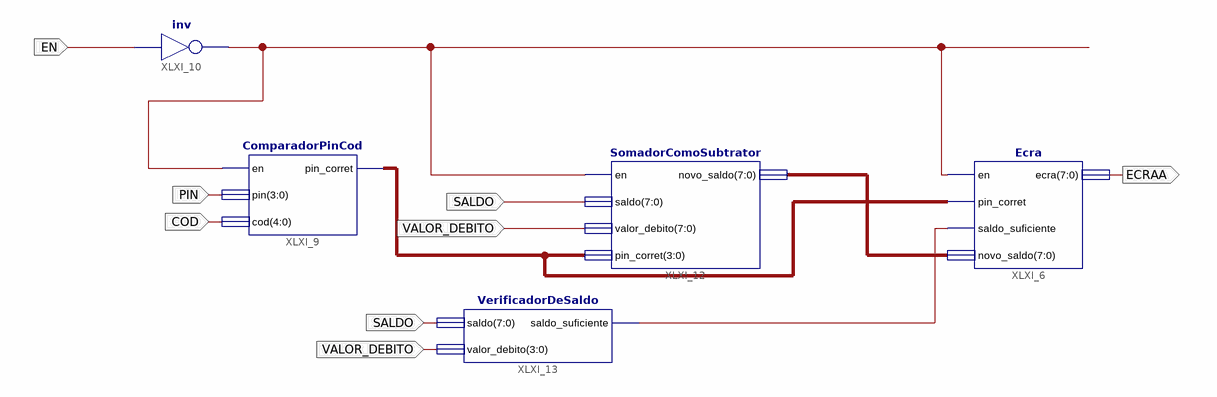
[diagram p0: schematic sheet 1]
// Xilinx ISE schematic Maquina.sch (spartan3) as structural Verilog: 5 symbols, 6 ports
module Maquina (
  input  EN,
  input  PIN,
  input  COD,
  input  SALDO,
  input  VALOR_DEBITO,
  output ECRAA
);

  wire XLXN_5, XLXN_14;
  wire [3:0] XLXN_21;
  wire [7:0] XLXN_22;

  Ecra XLXI_6 (.en(XLXN_5), .pin_corret(XLXN_21), .saldo_suficiente(XLXN_14), .novo_saldo(XLXN_22), .ecra({8{ECRAA}}));
  ComparadorPinCod XLXI_9 (.en(XLXN_5), .pin({4{PIN}}), .cod({5{COD}}), .pin_corret(XLXN_21));
  not XLXI_10 (XLXN_5, EN);
  SomadorComoSubtrator XLXI_12 (
    .en(XLXN_5), .saldo({8{SALDO}}), .valor_debito({8{VALOR_DEBITO}}), .pin_corret(XLXN_21),
    .novo_saldo(XLXN_22));
  VerificadorDeSaldo XLXI_13 (.saldo({8{SALDO}}), .valor_debito({4{VALOR_DEBITO}}), .saldo_suficiente(XLXN_14));
endmodule
